# Altium schematic sheet OuterMaskFinal.SchDoc
size A
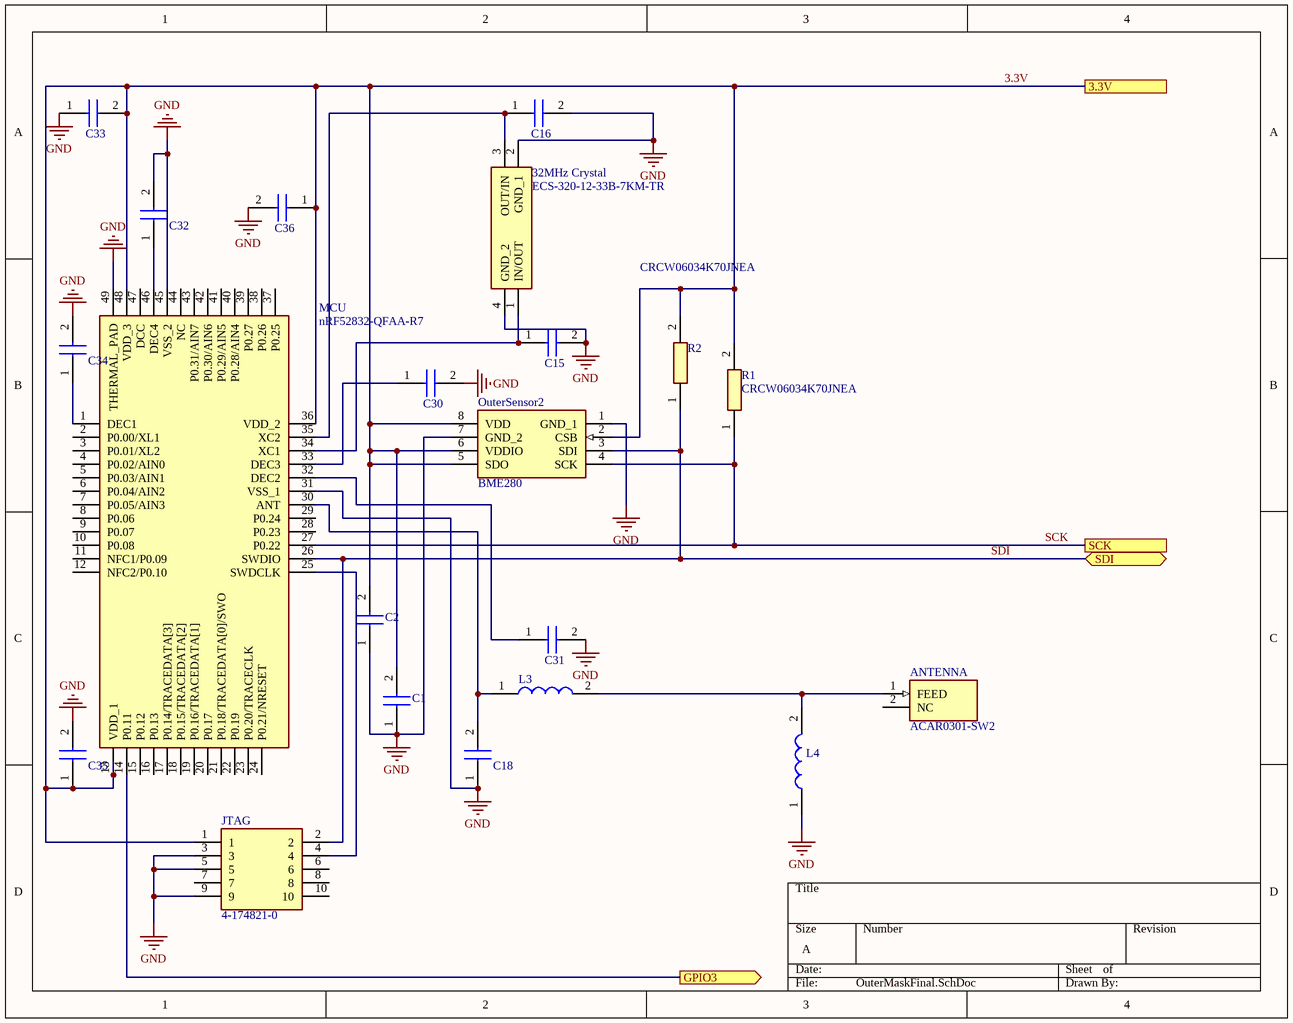
[diagram p0: OuterMaskFinal.SchDoc]

## Parts
32MHz_Crystal  ECS-320-12-33B-7KM-TR  [ECS3201233B7KMTR]
ANTENNA  ACAR0301-SW2  [ANTC3016X70N]
C1  06033C334KAT2A  [CAPC1608X90N]  (value not drawn)
C2  06033C334KAT2A  [CAPC1608X90N]  (value not drawn)
C15  06033C334KAT2A  [CAPC1608X90N]  (value not drawn)
C16  06033C334KAT2A  [CAPC1608X90N]  (value not drawn)
C18  06033C334KAT2A  [CAPC1608X90N]  (value not drawn)
C30  06033C334KAT2A  [CAPC1608X90N]  (value not drawn)
C31  06033C334KAT2A  [CAPC1608X90N]  (value not drawn)
C32  06033C334KAT2A  [CAPC1608X90N]  (value not drawn)
C33  06033C334KAT2A  [CAPC1608X90N]  (value not drawn)
C34  06033C334KAT2A  [CAPC1608X90N]  (value not drawn)
C35  06033C334KAT2A  [CAPC1608X90N]  (value not drawn)
C36  06033C334KAT2A  [CAPC1608X90N]  (value not drawn)
JTAG  4-174821-0  [TE_4-174821-0]
L3  0603CS-47NXGLU  [0603CS82NXGLW]  (value not drawn)
L4  0603CS-47NXGLU  [0603CS82NXGLW]  (value not drawn)
MCU  nRF52832-QFAA-R7  [QFN40P600X600X90-49N-D]
OuterSensor2  BME280  [BME280]
R1  CRCW06034K70JNEA  [RESC1608X50N]
R2  CRCW06034K70JNEA  [RESC1608X50N]

## Ports
3.3V, GPIO3 (out), SCK, SDI (bidir)

## Nets
GND: 32MHz_Crystal.2(GND_1) 32MHz_Crystal.4(GND_2) C1.1 C2.1 C15.2 C16.2 C18.1 C30.2 C31.2 C32.2 C33.1 C34.2 C35.2 C36.2 JTAG.3 JTAG.5 JTAG.9 L4.1 MCU.31(VSS_1) MCU.45(VSS_2) MCU.49(THERMAL_PAD) OuterSensor2.1(GND_1) OuterSensor2.7(GND_2)
3.3V: C1.2 C2.2 C33.2 C35.1 C36.1 JTAG.1 MCU.13(VDD_1) MCU.36(VDD_2) MCU.48(VDD_3) OuterSensor2.2(CSB) OuterSensor2.5(SDO) OuterSensor2.6(VDDIO) OuterSensor2.8(VDD) R1.2 R2.2 ; port 3.3V
GPIO3: MCU.14(P0.11) ; port GPIO3
SCK: MCU.27(P0.22) OuterSensor2.4(SCK) R1.1 ; port SCK
SDI: JTAG.2 MCU.26(SWDIO) OuterSensor2.3(SDI) R2.1 ; port SDI
Net32MHz_Crystal_1: 32MHz_Crystal.1(IN/OUT) C15.1 MCU.34(XC1)
Net32MHz_Crystal_3: 32MHz_Crystal.3(OUT/IN) C16.1 MCU.35(XC2)
NetANTENNA_1: ANTENNA.1(FEED) L3.2 L4.2
NetC18_2: C18.2 L3.1 MCU.30(ANT)
NetC30_1: C30.1 MCU.33(DEC3)
NetC31_1: C31.1 MCU.32(DEC2)
NetC32_1: C32.1 MCU.46(DEC4)
NetC34_1: C34.1 MCU.1(DEC1)
NetJTAG_4: JTAG.4 MCU.25(SWDCLK)

Not connected (* = marked no-connect by the designer): ANTENNA 2(NC); JTAG 6 7 8 10; MCU 2(P0.00/XL1) 3(P0.01/XL2) 4(P0.02/AIN0) 5(P0.03/AIN1) 6(P0.04/AIN2) 7(P0.05/AIN3) 8(P0.06) 9(P0.07) 10(P0.08) 11(NFC1/P0.09) 12(NFC2/P0.10) 15(P0.12) 16(P0.13) 17(P0.14/TRACEDATA[3]) 18(P0.15/TRACEDATA[2]) 19(P0.16/TRACEDATA[1]) 20(P0.17) 21(P0.18/TRACEDATA[0]/SWO) 22(P0.19) 23(P0.20/TRACECLK) 24(P0.21/NRESET) 28(P0.23) 29(P0.24) 37(P0.25) 38(P0.26) 39(P0.27) 40(P0.28/AIN4) 41(P0.29/AIN5) 42(P0.30/AIN6) 43(P0.31/AIN7) 44(NC) 47(DCC)

## Library data of the parts
32MHz_Crystal = ECS-320-12-33B-7KM-TR: Crystal or Oscillator; Manufacturer_Name: ECS; Datasheet Link: https://componentsearchengine.com/Datasheets/1/ECS-320-12-33B-7KM-TR.pdf; Height: 0.8mm; Manufacturer_Part_Number: ECS-320-12-33B-7KM-TR; Mouser Part Number: 520-320-12-33B-7KM-T; Mouser Price/Stock: https://www.mouser.co.uk/ProductDetail/ECS/ECS-320-12-33B-7KM-TR/?qs=B6kkDfuK7%2FDHiq3Iv4aaAw%3D%3D; Arrow Part Number: ECS-320-12-33B-7KM-TR; Arrow Price/Stock: https://www.arrow.com/en/products/ecs-320-12-33b-7km-tr/ecs-international
ANTENNA = ACAR0301-SW2: Antenna; Manufacturer_Name: ABRACON; Datasheet Link: https://abracon.com/datasheets/ACAR0301-SW2.pdf; Height: 0.7mm; Manufacturer_Part_Number: ACAR0301-SW2; Mouser Part Number: 815-ACAR0301-SW2; Mouser Price/Stock: https://www.mouser.co.uk/ProductDetail/ABRACON/ACAR0301-SW2?qs=0lSvoLzn4L%2FmzcOh8j1UbQ%3D%3D
C1 C2 C15 C16 C18 C30-C36 = 06033C334KAT2A: Capacitor; Manufacturer_Name: AVX; Datasheet Link: https://componentsearchengine.com/Datasheets/1/06031A100FAT2A.pdf; Height: 0.9mm; Manufacturer_Part_Number: 06033C334KAT2A; Mouser Part Number: 581-06033C334KAT2A; Mouser Price/Stock: https://www.mouser.com/Search/Refine.aspx?Keyword=581-06033C334KAT2A
JTAG = 4-174821-0: Conn Fine Pitch Connector HDR 10 POS 1.25mm Solder ST SMD Loose Piece; Centerline_Pitch: 1.25 mm[.049 in]; Number_of_Positions: 10; MF: TE Connectivity; Check_prices: https://www.snapeda.com/parts/4-174821-0/TE%20Connectivity%20AMP%20Connectors/view-part/2816133/?ref=eda; Value: *; Product_Type: Connector; Package: None; MP: 4-174821-0; Purchase-URL: https://pricing.snapeda.com/search/part/4-174821-0/?ref=eda; SnapEDA_Link: https://www.snapeda.com/parts/4-174821-0/TE%20Connectivity%20AMP%20Connectors/view-part/2816133/?ref=snap; Digi-Key_Part_Number: A144930-ND
L3 L4 = 0603CS-47NXGLU: Inductor; Manufacturer_Name: COILCRAFT; Datasheet Link: https://www.coilcraft.com/pdfs/0603cs.pdf; Height: 1mm; Manufacturer_Part_Number: 0603CS-47NXGLU; Mouser Part Number: 994-0603CS-47NXGLU; Mouser Price/Stock: https://www.mouser.com/Search/Refine.aspx?Keyword=994-0603CS-47NXGLU
MCU = nRF52832-QFAA-R7: Integrated Circuit; Manufacturer_Name: Nordic Semiconductor; Datasheet Link: https://componentsearchengine.com//nRF52832-QFAA-R7.pdf; Height: 0.9mm; Mouser2 Part Number: 949-NRF52832-QFAA-R7; Mouser2 Price/Stock: https://www.mouser.com/Search/Refine.aspx?Keyword=949-NRF52832-QFAA-R7; Manufacturer_Part_Number: nRF52832-QFAA-R7
OuterSensor2 = BME280: Hygrometer; Manufacturer_Name: Bosch Sensortec; Datasheet Link: http://ae-bst.resource.bosch.com/media/products/dokumente/bme280/BST-BME280_DS001-11.pdf; Manufacturer_Part_Number: BME280; Arrow Part Number: BME280; Arrow Price/Stock: https://www.arrow.com/en/products/bme280/bosch; Mouser Part Number: 262-BME280; Mouser Price/Stock: https://www.mouser.co.uk/ProductDetail/Bosch-Sensortec/BME280?qs=2OnyuXx6vpj2fK9HX7qb3g%3D%3D
R1 R2 = CRCW06034K70JNEA: Resistor; Manufacturer_Name: Vishay; Datasheet Link: http://www.vishay.com/docs/20035/dcrcwe3.pdf; Height: 0.5mm; Manufacturer_Part_Number: CRCW06034K70JNEA; Arrow Part Number: CRCW06034K70JNEA; Arrow Price/Stock: https://www.arrow.com/en/products/crcw06034k70jnea/vishay; Mouser Part Number: 71-CRCW0603J-4.7K-E3; Mouser Price/Stock: https://www.mouser.co.uk/ProductDetail/Vishay-Dale/CRCW06034K70JNEA?qs=C0xaqriB68jbLUpBrIbing%3D%3D